# EAGLE design TimeSeedsVPClock (EAGLE 9.6.2)
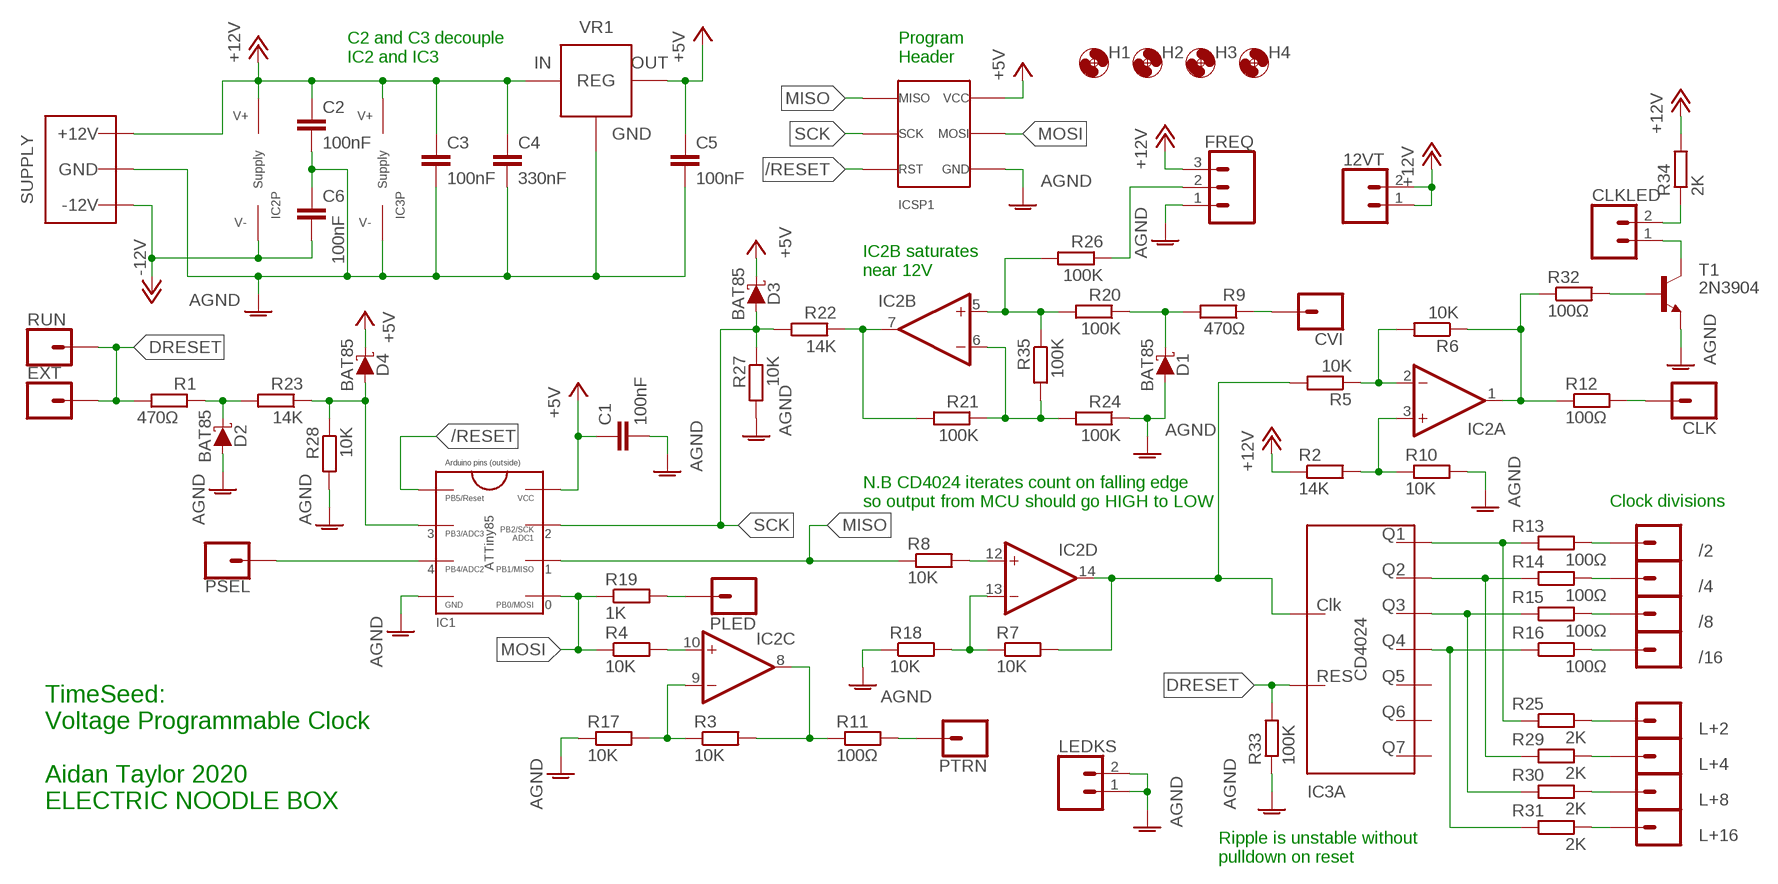
[diagram p0: schematic, sheet 1]

## Parts
12VT  2XWIREPAD  [1X02]
/2  1XWIREPAD  [1X01]
/4  1XWIREPAD  [1X01]
/8  1XWIREPAD  [1X01]
/16  1XWIREPAD  [1X01]
C1  100nF  C-EU050-025X075  [C050-025X075]
C2  100nF  C-EU050-025X075  [C050-025X075]
C3  100nF  C-EU050-025X075  [C050-025X075]
C4  330nF  C-EU050-025X075  [C050-025X075]
C5  100nF  C-EU050-025X075  [C050-025X075]
C6  100nF  C-EU050-025X075  [C050-025X075]
CLK  1XWIREPAD  [1X01]
CLKLED  2XWIREPAD  [1X02]
CVI  1XWIREPAD  [1X01]
D1  BAT85  SCHOTTKY_DO35  [DO35-7]
D2  BAT85  SCHOTTKY_DO35  [DO35-7]
D3  BAT85  SCHOTTKY_DO35  [DO35-7]
D4  BAT85  SCHOTTKY_DO35  [DO35-7]
EXT  1XWIREPAD  [1X01]
FREQ  3XWIREPAD  [1X03]
H1  MOUNT-HOLE3.2  [3,2]
H2  MOUNT-HOLE3.2  [3,2]
H3  MOUNT-HOLE3.2  [3,2]
H4  MOUNT-HOLE3.2  [3,2]
IC1  ATTINY2/4/85  [DIL08]
IC2  LM324  [DIL14]
IC3  CD4024BDIL  [DIL14]
ICSP1  ICSP_2.54  [2X3]
L+2  1XWIREPAD  [1X01]
L+4  1XWIREPAD  [1X01]
L+8  1XWIREPAD  [1X01]
L+16  1XWIREPAD  [1X01]
LEDKS  2XWIREPAD  [1X02]
PLED  1XWIREPAD  [1X01]
PSEL  1XWIREPAD  [1X01]
PTRN  1XWIREPAD  [1X01]
R1  470Ω  R-EU_0207/10  [0207/10]
R2  14K  R-EU_0207/10  [0207/10]
R3  10K  R-EU_0207/10  [0207/10]
R4  10K  R-EU_0207/10  [0207/10]
R5  10K  R-EU_0207/10  [0207/10]
R6  10K  R-EU_0207/10  [0207/10]
R7  10K  R-EU_0207/10  [0207/10]
R8  10K  R-EU_0207/10  [0207/10]
R9  470Ω  R-EU_0207/10  [0207/10]
R10  10K  R-EU_0207/10  [0207/10]
R11  100Ω  R-EU_0207/10  [0207/10]
R12  100Ω  R-EU_0207/10  [0207/10]
R13  100Ω  R-EU_0207/10  [0207/10]
R14  100Ω  R-EU_0207/10  [0207/10]
R15  100Ω  R-EU_0207/10  [0207/10]
R16  100Ω  R-EU_0207/10  [0207/10]
R17  10K  R-EU_0207/10  [0207/10]
R18  10K  R-EU_0207/10  [0207/10]
R19  1K  R-EU_0207/10  [0207/10]
R20  100K  R-EU_0207/10  [0207/10]
R21  100K  R-EU_0207/10  [0207/10]
R22  14K  R-EU_0207/10  [0207/10]
R23  14K  R-EU_0207/10  [0207/10]
R24  100K  R-EU_0207/10  [0207/10]
R25  2K  R-EU_0207/10  [0207/10]
R26  100K  R-EU_0207/10  [0207/10]
R27  10K  R-EU_0207/10  [0207/10]
R28  10K  R-EU_0207/10  [0207/10]
R29  2K  R-EU_0207/10  [0207/10]
R30  2K  R-EU_0207/10  [0207/10]
R31  2K  R-EU_0207/10  [0207/10]
R32  100Ω  R-EU_0207/10  [0207/10]
R33  100K  R-EU_0207/10  [0207/10]
R34  2K  R-EU_0207/10  [0207/10]
R35  100K  R-EU_0207/10  [0207/10]
RUN  1XWIREPAD  [1X01]
T1  2N3904  [TO92]
VR1  L78L05TO92  [TO92]
WP1  COMBO_SUPPLY_HEADER  [COMBINED_POWER]

## Nets
+5V: C1.1 C5.1 D3.C D4.C IC1.8(VCC) ICSP1.2(6VCC) VR1.1(VOUT)
+12V: 12VT.1 12VT.2 C2.1 C3.1 C4.1 FREQ.3 IC2.4(P:V+) IC3.14(P:V+) R2.1 R34.2 VR1.3(VIN) WP1.V+1(V++) WP1.V+2(V++) WP1.V+3(V++)
-12V: C6.2 IC2.11(P:V-) WP1.V-1(V--) WP1.V-2(V--) WP1.V-3(V--)
/RESET: IC1.1(RESET) ICSP1.5(3RST)
AGND: C1.2 C2.2 C3.2 C4.2 C5.2 C6.1 D1.A D2.A FREQ.1 IC1.4(GND) IC3.7(P:V-) ICSP1.6(4GND) LEDKS.1 LEDKS.2 R10.2 R17.1 R18.1 R24.1 R27.2 R28.2 R33.1 T1.3(E) VR1.2(GND) WP1.GND1(AGND) WP1.GND2(AGND) WP1.GND3(AGND) WP1.GND4(AGND) WP1.GND5(AGND) WP1.GND6(AGND) WP1.GND7(AGND) WP1.GND8(AGND)
DRESET: EXT.1 IC3.2(A:RESET) R1.2 R33.2 RUN.1
MISO: IC1.6(PB1) ICSP1.1(1MISO) R8.1
MOSI: IC1.5(PB0) ICSP1.4(5MOSI) R4.1 R19.1
N$1: D1.C R9.2 R20.1
N$3: CVI.1 R9.1
N$4: IC2.10(C:+IN) R4.2
N$5: IC2.9(C:-IN) R3.1 R17.2
N$6: IC2.2(A:-IN) R5.1 R6.2
N$7: D2.C R1.1 R23.2
N$8: IC2.12(D:+IN) R8.2
N$9: PLED.1 R19.2
N$10: IC2.8(C:OUT) R3.2 R11.1
N$11: PTRN.1 R11.2
N$12: IC2.1(A:OUT) R6.1 R12.1 R32.1
N$13: IC3.12(A:Q1) R13.1 R25.1
N$14: IC3.11(A:Q2) R14.1 R29.1
N$15: IC3.9(A:Q3) R15.1 R30.1
N$16: IC3.6(A:Q4) R16.1 R31.1
N$17: L+2.1 R25.2
N$18: L+4.1 R29.2
N$19: L+8.1 R30.2
N$20: IC2.5(B:+IN) R20.2 R26.2 R35.1
N$21: IC2.7(B:OUT) R21.2 R22.1
N$22: IC2.3(A:+IN) R2.2 R10.1
N$23: CLK.1 R12.2
N$24: IC1.3(PB4) PSEL.1
N$25: IC2.6(B:-IN) R21.1 R24.2 R35.2
N$26: CLKLED.2 R34.1
N$27: FREQ.2 R26.1
N$28: IC2.13(D:-IN) R7.1 R18.2
N$29: /2.1 R13.2
N$30: /4.1 R14.2
N$31: /8.1 R15.2
N$32: /16.1 R16.2
N$33: IC2.14(D:OUT) IC3.1(A:CLK) R5.2 R7.2
N$34: L+16.1 R31.2
N$35: CLKLED.1 T1.1(C)
N$36: R32.2 T1.2(B)
NOTRES: D4.A IC1.2(PB3) R23.1 R28.1
SCK: D3.A IC1.7(PB2) ICSP1.3(2SCK) R22.2 R27.1
Unconnected: IC3.3(A:Q7) IC3.4(A:Q6) IC3.5(A:Q5)

## Notes on the sheet
- C2 and C3 decouple
  IC2 and IC3
- Program
  Header
- IC2B saturates 
  near 12V
- N.B CD4024 iterates count on falling edge
  so output from MCU should go HIGH to LOW
- Clock divisions
- TimeSeed:
  Voltage Programmable Clock
  
  Aidan Taylor 2020
  ELECTRIC NOODLE BOX
- Ripple is unstable without 
  pulldown on reset

## Library data of the parts
12VT CLKLED LEDKS = ElectricNoodleBox:2XWIREPAD
/2 /4 /8 /16 CLK CVI EXT L+2 L+4 L+8 L+16 PLED PSEL PTRN RUN = ElectricNoodleBox:1XWIREPAD
C1-C6 = rcl:C-EU: CAPACITOR, European symbol; SPICEPREFIX: C
D1-D4 = ElectricNoodleBox:SCHOTTKY_DO35
FREQ = ElectricNoodleBox:3XWIREPAD
H1-H4 = holes:MOUNT-HOLE: MOUNTING HOLE with drill center marker
IC1 = ElectricNoodleBox:ATTINY2/4/85
IC2 = ElectricNoodleBox:LM324
IC3 = ElectricNoodleBox:CD4024B
ICSP1 = ElectricNoodleBox:ICSP_2.54
R1-R35 = rcl:R-EU_: RESISTOR, European symbol; SPICEPREFIX: R
T1 = transistor:2N3904: NPN TRANSISTOR
VR1 = ElectricNoodleBox:L78L05
WP1 = ElectricNoodleBox:COMBO_SUPPLY_HEADER

## Board
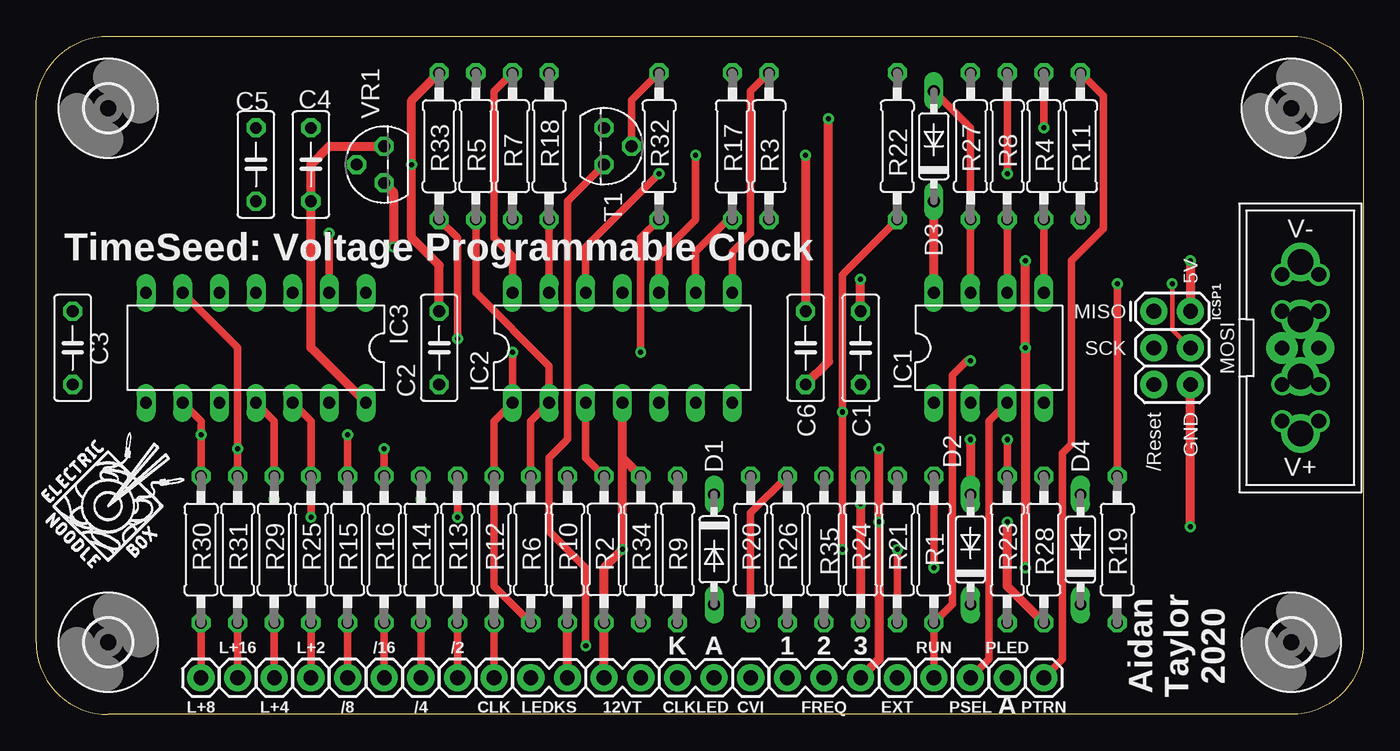
[diagram p1: board, top side]
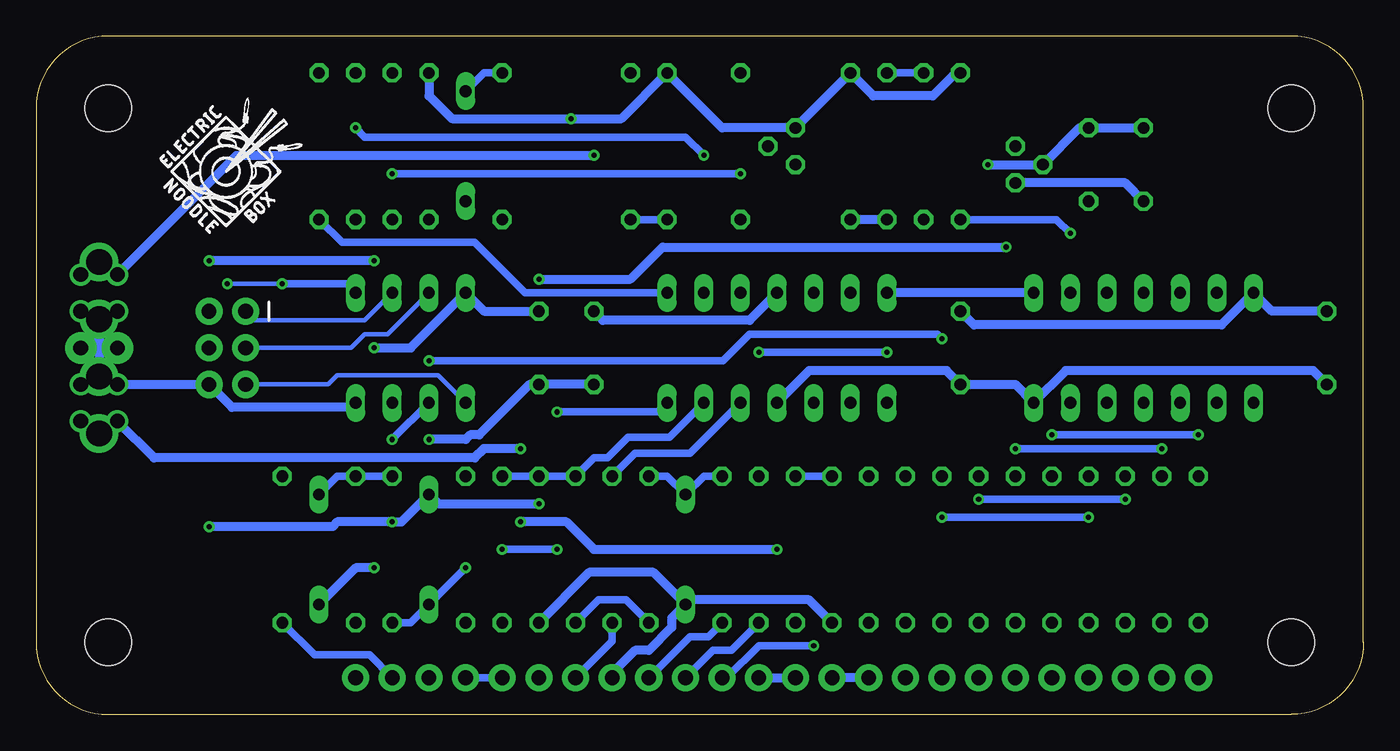
[diagram p2: board, bottom side, seen from below]

Size 92 x 47 mm. Coordinates in mm from the lower left corner, seen from the top.
Outline: 0,5 arc90 5,0 87,0 arc90 92,5 92,42 arc90 87,47 5,47 arc90 0,42 0,5
Copper layers (1*16): Top 0.035mm / dielectric 1.5mm / Bottom 0.035mm
Design rules "default": minimum track width 6mil, minimum drill 0.35mm, track to track 6mil, track to pad 6mil, pad to pad 6mil, via to via 6mil, smd to smd 6mil, copper to edge 40mil, drill to drill 6mil, minimum pad ring 10mil, minimum via ring 8mil, stop-mask expansion 4mil, vias tented up to drill 0mil, thermal gap 10mil

### Footprints (pad centres in the part's own frame; a part is rotated, then mirrored left to right if it is on the bottom)
1X02 = drill 1.016 pad 1.88: 1 0,0; 2 2.54,0
1X01 = drill 1.016 pad 1.88: 1 0,0
C050-025X075 = drill 0.813 octagon: 1 -2.54,0; 2 2.54,0
DO35-7 = drill 0.813 long: A 3.81,0; C -3.81,0
1X03 = drill 1.016 pad 1.88: 1 0,0; 2 2.54,0; 3 5.08,0
3,2 = hole 3.2: 0,0
DIL08 = drill 0.813 long: 1 -3.81,-3.81; 2 -1.27,-3.81; 3 1.27,-3.81; 4 3.81,-3.81; 5 3.81,3.81; 6 1.27,3.81; 7 -1.27,3.81; 8 -3.81,3.81
DIL14 = drill 0.813 long: 1 -7.62,-3.81; 2 -5.08,-3.81; 3 -2.54,-3.81; 4 0,-3.81; 5 2.54,-3.81; 6 5.08,-3.81; 7 7.62,-3.81; 8 7.62,3.81; 9 5.08,3.81; 10 2.54,3.81; 11 0,3.81; 12 -2.54,3.81; 13 -5.08,3.81; 14 -7.62,3.81
2X3 = drill 1.016 pad 1.88: 1 0,0; 2 0,2.54; 3 2.54,0; 4 2.54,2.54; 5 5.08,0; 6 5.08,2.54
0207/10 = drill 0.813 octagon: 1 -5.08,0; 2 5.08,0
TO92 = drill 0.813 octagon: 1 1.27,0; 2 0,1.905; 3 -1.27,0
TO92' = drill 0.813 octagon: 1 -1.27,0; 2 0,1.905; 3 1.27,0
COMBINED_POWER = drill 1.78: GND1 -1.98,0; GND2 1.98,0; V+1 -5.94,0; V-1 5.94,0 | drill 1.016: GND3 -2.54,1.27; GND5 2.54,1.27; GND6 -2.54,-1.27; GND8 2.54,-1.27; V+2 -5.08,1.27; V+3 -5.08,-1.27; V-2 5.08,1.27; V-3 5.08,-1.27 | drill 1.016 pad 2.184: GND4 0,1.27; GND7 0,-1.27

### Placement (x,y rotation side)
12VT  39.37,2.54 0 top
/2  29.21,2.54 0 top
/4  26.67,2.54 0 top
/8  21.59,2.54 0 top
/16  24.13,2.54 0 top
C1  57.15,25.4 270 top
C2  27.94,25.4 90 top
C3  2.54,25.4 90 top
C4  19.05,38.1 90 top
C5  15.24,38.1 90 top
C6  53.34,25.4 90 top
CLK  31.75,2.54 0 top
CLKLED  44.45,2.54 0 top
CVI  49.53,2.54 0 top
D1  46.99,11.43 270 top
D2  64.77,11.43 90 top
D3  62.23,39.37 90 top
D4  72.39,11.43 90 top
EXT  59.69,2.54 0 top
FREQ  52.07,2.54 0 top
H1  5,5 0 top
H2  87,5 0 top
H3  87,42 0 top
H4  5,42 0 top
IC1  66.04,25.4 0 top
IC2  40.64,25.4 0 top
IC3  15.24,25.4 180 top
ICSP1  77.47,27.94 270 top
L+2  19.05,2.54 0 top
L+4  16.51,2.54 0 top
L+8  11.43,2.54 0 top
L+16  13.97,2.54 0 top
LEDKS  34.29,2.54 0 top
PLED  67.31,2.54 0 top
PSEL  64.77,2.54 0 top
PTRN  69.85,2.54 0 top
R1  62.23,11.43 270 top
R2  39.37,11.43 90 top
R3  50.8,39.37 90 top
R4  69.85,39.37 90 top
R5  30.48,39.37 90 top
R6  34.29,11.43 90 top
R7  33.02,39.37 90 top
R8  67.31,39.37 90 top
R9  44.45,11.43 90 top
R10  36.83,11.43 270 top
R11  72.39,39.37 90 top
R12  31.75,11.43 270 top
R13  29.21,11.43 270 top
R14  26.67,11.43 270 top
R15  21.59,11.43 270 top
R16  24.13,11.43 270 top
R17  48.26,39.37 270 top
R18  35.56,39.37 270 top
R19  74.93,11.43 270 top
R20  49.53,11.43 270 top
R21  59.69,11.43 270 top
R22  59.69,39.37 90 top
R23  67.31,11.43 270 top
R24  57.15,11.43 90 top
R25  19.05,11.43 270 top
R26  52.07,11.43 90 top
R27  64.77,39.37 90 top
R28  69.85,11.43 270 top
R29  16.51,11.43 270 top
R30  11.43,11.43 270 top
R31  13.97,11.43 270 top
R32  43.18,39.37 90 top
R33  27.94,39.37 270 top
R34  41.91,11.43 90 top
R35  54.61,11.43 90 top
RUN  62.23,2.54 0 top
T1  39.37,39.37 270 top
U$1  [LOGO10X10]  0.32,9.84 0 top
U$2  [LOGO10X10]  83.5,33.02 0 bottom
VR1  [TO92']  24.13,38.1 90 top
WP1  87.63,25.4 90 top

### Tracks (layer width: path | path; a pad name or v marks a point on that pad's centre or on a via)
+5V  (via drill 0.35)
  Top 0.61: IC1.8 D3.C | v68.58,31.43 v68.58,25.4 v68.58,10.16 | v80.01,31.43 ICSP1.2 | C1.1 v57.15,30.16 | v24.77,32.38 24.77,36.2 VR1.1
  Bottom 0.61: v68.58,25.4 66.04,25.4 IC1.8 60.96,27.94 C1.1 | v68.58,31.43 v80.01,31.43 | v57.15,30.16 50.8,30.16 48.58,32.38 v24.77,32.38 | C5.1 16.51,36.83 VR1.1 | D4.C 69.85,10.16 v68.58,10.16
+12V  (via drill 0.35)
  Top 0.61: 40.64,17.78 v40.64,11.43 39.37,10.16 R2.1 12VT.1 | 40.64,17.78 IC2.4 | R34.2 40.64,17.78 | IC3.14 19.05,25.4 C4.1 19.05,38.1 20.32,39.37 VR1.3 | v58.42,18.41 v58.42,13.34 58.42,3.81 FREQ.3
  Bottom 0.61: v40.64,11.43 53.34,11.43 55.24,13.34 v58.42,13.34 | C3.1 3.49,23.81 20.64,23.81 IC3.14 24.13,22.86 C2.1 28.89,23.81 38.42,23.81 IC2.4 | v58.42,18.41 60.96,18.41 61.59,17.78 83.82,17.78 WP1.V+2 86.77,20.32 WP1.V+1 88.49,20.32 WP1.V+3 | 12VT.2 12VT.1
-12V  (via drill 0.35)
  Top 0.61: v53.34,38.73 C6.2
  Bottom 0.61: IC2.11 42.55,27.3 52.7,27.3 C6.2 | v53.34,38.73 78.11,38.73 WP1.V-2 87.22,31.34 WP1.V-1 88.49,30.48 WP1.V-3
/RESET
  Bottom 0.305: ICSP1.5 71.75,22.86 71.12,23.5 64.14,23.5 IC1.1
AGND  (via drill 0.35)
  Top 0.61: C2.2 27.94,31.11 26.04,33.02 v26.04,38.1 26.04,42.55 R33.1 | C6.1 54.93,24.45 v54.93,41.27 | LEDKS.2 R10.2 | R28.2 67.31,8.89 v67.31,13.34 | v80.01,13.02 ICSP1.6 | v64.77,19.05 D2.A | v57.15,14.61 R24.1
  Bottom 0.61: R10.2 38.42,7.94 46.67,7.94 D1.A | D1.A 49.21,9.84 53.66,9.84 R24.1 | IC1.4 70.17,21.27 78.42,21.27 ICSP1.6 WP1.GND3 87.07,22.86 WP1.GND1 | C3.2 6.35,27.94 IC3.7 9.84,26.99 26.99,26.99 C2.2 | C6.1 C1.2 57.78,22.86 61.28,19.37 61.91,19.37 62.23,19.05 v64.77,19.05 | v26.04,38.1 VR1.2 19.68,40.64 C4.2 C5.2 | R33.1 28.26,44.45 29.84,42.86 33.97,42.86 R18.1 T1.3 44.45,40.64 R17.1 51.44,41.27 v54.93,41.27 63.18,41.27 64.77,42.86 R27.2 | WP1.GND2 86.92,27.38 WP1.GND5 | WP1.GND2 88.34,27.38 WP1.GND8 | WP1.GND2 WP1.GND1 | WP1.GND1 88.34,23.42 WP1.GND6 | WP1.GND4 WP1.GND7 87.63,26.67 WP1.GND2 | LEDKS.1 LEDKS.2 | D1.A 47.94,6.67 47.94,6.03 49.53,4.45 50.48,4.45 52.07,2.86 FREQ.1 | v80.01,13.02 71.44,13.02 71.12,13.34 v67.31,13.34 66.67,13.34 D2.A 64.14,14.61 v57.15,14.61
DRESET  (via drill 0.35)
  Top 0.508: R33.2 29.21,33.02 v29.21,26.04 | v20.32,33.34 IC3.2 | RUN.1 R1.2 63.5,7.62 63.5,23.5 64.5,24.5 v64.77,24.5
  Bottom 0.508: v64.77,24.5 44.4,24.5 42.55,26.35 29.53,26.35 v29.21,26.04 | R33.2 21.27,34.29 v20.32,33.34 | RUN.1 EXT.1
MISO
  Top 0.508: IC1.6 R8.1
  Bottom 0.305: IC1.6 69.22,27.3 76.83,27.3 ICSP1.1
MOSI  (via drill 0.35)
  Top 0.305: ICSP1.4 78.74,26.67 v78.74,29.84
  Top 0.508: R19.1 v74.93,29.84 | IC1.5 R4.1
  Bottom 0.305: v78.74,29.84 v74.93,29.84
  Bottom 0.508: v74.93,29.84 70.48,29.84 IC1.5
N$1
  Bottom 0.508: R9.2 45.72,16.51 D1.C 48.26,16.51 R20.1
N$3
  Bottom 0.508: R9.1 45.4,5.4 46.67,5.4 CVI.1
N$4  (via drill 0.35)
  Top 0.508: IC2.10 43.18,31.75 45.72,34.29 v45.72,38.73 | v69.85,40.64 R4.2
  Bottom 0.508: v69.85,40.64 69.22,40.01 46.99,40.01 v45.72,38.73
N$5
  Top 0.508: IC2.9 45.72,32.07 47.94,34.29 R17.2
  Bottom 0.508: R17.2 R3.1
N$6
  Top 0.508: R6.2 34.29,20.32 IC2.2 35.56,24.13 30.48,29.21 R5.1
N$7  (via drill 0.35)
  Top 0.508: R1.1 v62.23,10.16
  Bottom 0.508: R23.2 66.04,6.35 D2.C v62.23,10.16
N$8  (via drill 0.35)
  Top 0.508: IC2.12 38.1,32.38 v43.18,37.47 | R8.2 v67.31,37.47
  Bottom 0.508: v43.18,37.47 66.67,37.47 v67.31,37.47
N$9
  Bottom 0.508: R19.2 72.71,4.13 68.9,4.13 PLED.1
N$10
  Top 0.508: IC2.8 48.26,32.07 49.53,33.34 49.53,43.18 R3.2
  Bottom 0.508: IC2.8 58.1,29.21 61.59,32.7 70.8,32.7 R11.1
N$11
  Top 0.508: R11.2 73.98,42.86 73.98,33.66 71.75,31.43 71.75,18.73 71.12,18.1 71.12,3.81 PTRN.1
N$12  (via drill 0.35)
  Top 0.508: R6.1 31.75,8.89 R12.1 31.75,20.32 IC2.1 v33.02,25.08 | v41.91,25.08 41.91,33.02 R32.1
  Bottom 0.508: v41.91,25.08 v33.02,25.08
N$13  (via drill 0.35)
  Top 0.508: IC3.12 19.05,20.32 R25.1 v19.05,13.65 | v29.21,13.65 R13.1
  Bottom 0.508: v19.05,13.65 v29.21,13.65
N$14  (via drill 0.35)
  Top 0.508: IC3.11 16.51,20.32 R29.1 v16.51,14.92 | v26.67,14.92 R14.1
  Bottom 0.508: v16.51,14.92 v26.67,14.92
N$15  (via drill 0.35)
  Top 0.508: IC3.9 11.43,20.32 v11.43,19.37 R30.1 | v21.59,19.37 R15.1
  Bottom 0.508: v11.43,19.37 v21.59,19.37
N$16  (via drill 0.35)
  Top 0.508: IC3.6 13.97,25.4 v13.97,18.41 R31.1 | v24.13,18.41 R16.1
  Bottom 0.508: v13.97,18.41 v24.13,18.41
N$17
  Top 0.508: R25.2 L+2.1
N$18
  Top 0.508: R29.2 L+4.1
N$19
  Top 0.508: R30.2 L+8.1
N$20
  Top 0.508: R26.2 49.53,13.97 R20.2
  Bottom 0.508: IC2.5 46.67,18.1 50.48,18.1 R26.2 | R20.2 51.12,7.94 53.02,7.94 R35.1
N$21  (via drill 0.35)
  Top 0.508: R22.1 55.88,30.48 v55.88,20.95 v55.88,11.43 | v59.69,11.43 R21.2
  Bottom 0.508: v55.88,20.95 48.9,20.95 IC2.7 | v55.88,11.43 v59.69,11.43
N$22
  Top 0.508: R2.2 38.1,17.78 IC2.3
  Bottom 0.508: R10.1 R2.2
N$23
  Top 0.508: CLK.1 R12.2
N$24
  Top 0.508: IC1.3 66.04,20.32 66.04,3.81 PSEL.1
N$25
  Bottom 0.508: IC2.6 48.1,19.21 50.96,19.21 52.39,17.78 53.34,17.78 R35.2 R24.2 R21.1
N$26
  Bottom 0.508: CLKLED.2 45.09,4.45 43.81,4.45 R34.1
N$27
  Bottom 0.508: R26.1 52.07,5.08 FREQ.2
N$28
  Top 0.508: IC2.13 R18.2
  Bottom 0.61: R7.1 R18.2
N$29
  Top 0.508: R13.2 /2.1
N$30
  Top 0.508: R14.2 /4.1
N$31
  Top 0.508: R15.2 /8.1
N$32
  Top 0.508: R16.2 /16.1
N$33
  Top 0.508: IC2.14 33.02,31.75 31.75,33.02 31.75,43.18 R7.2
  Bottom 0.508: R5.2 R7.2
  Bottom 0.61: IC3.1 IC2.14
N$34
  Top 0.508: R31.2 L+16.1
N$35  (via drill 0.35)
  Top 0.508: T1.1 36.83,35.56 36.83,19.05 35.56,17.78 35.56,12.7 38.1,10.16 v38.1,4.76
  Bottom 0.508: CLKLED.1 44.13,2.54 41.91,4.76 v38.1,4.76
N$36
  Top 0.508: T1.2 41.27,42.55 R32.2
NOTRES  (via drill 0.35)
  Top 0.508: v67.31,19.05 R23.1
  Bottom 0.508: R23.1 R28.1 71.12,16.51 D4.A | IC1.2 v67.31,19.05
SCK
  Top 0.508: IC1.7 R27.1 64.77,40.64 D3.A
  Bottom 0.305: ICSP1.3 70.17,25.4 69.22,26.35 67.63,26.35 IC1.7
  Bottom 0.508: R22.2 60.96,44.45 D3.A

### Text on the board
tPlace: TimeSeed: Voltage Programmable Clock | 5V | MISO | SCK | MOSI | /Reset | GND | K | A | 1 | 2 | 3 | Aidan / Taylor / 2020 | A